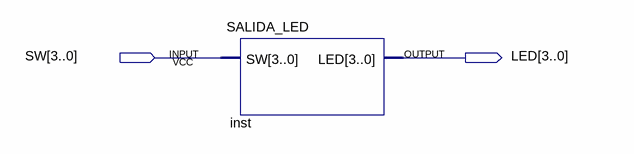
[diagram p0: schematic sheet]
// Quartus schematic TAREA1_B.bdf as structural Verilog: 1 symbols, 2 pins
module TAREA1_B (
  input  [3:0] SW,
  output [3:0] LED
);

  SALIDA_LED inst (.SW(SW), .LED(LED));
endmodule
